# Altium project NUCLEO-F410RB-Extend-Board.PrjPcb
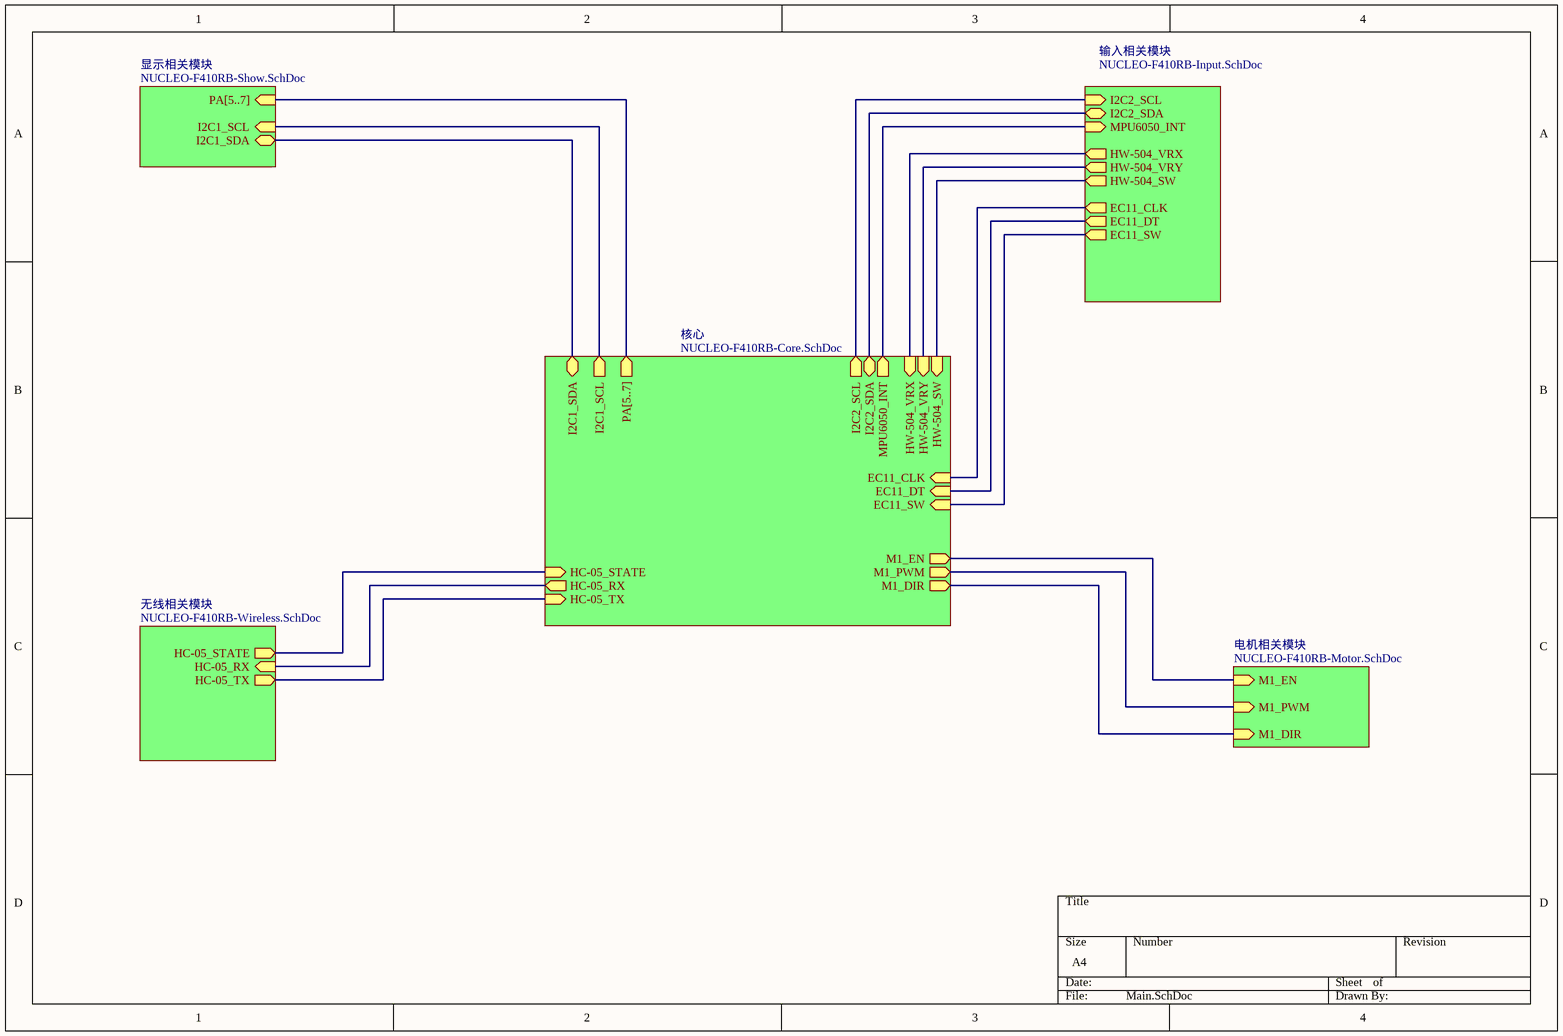
[diagram p0: Main.SchDoc]
6 sheets, 60 parts. Net scope: hierarchical (ports join the sheet entries above them; power ports are global).
Board file: NUCLEO-F410RB-Extend-Board.PcbDoc
Sheets:
  Main.SchDoc
    核心 = NUCLEO-F410RB-Core.SchDoc
    输入相关模块 = NUCLEO-F410RB-Input.SchDoc
    电机相关模块 = NUCLEO-F410RB-Motor.SchDoc
    显示相关模块 = NUCLEO-F410RB-Show.SchDoc
    无线相关模块 = NUCLEO-F410RB-Wireless.SchDoc

## Sheet Main.SchDoc
size A4

### Sub-sheets
无线相关模块 = NUCLEO-F410RB-Wireless.SchDoc: HC-05_STATE (out), HC-05_RX (in), HC-05_TX (out)
显示相关模块 = NUCLEO-F410RB-Show.SchDoc: PA[5..7] (in), I2C1_SCL (in), I2C1_SDA (bidir)
核心 = NUCLEO-F410RB-Core.SchDoc: M1_EN (out), M1_PWM (out), M1_DIR (out), PA[5..7] (out), I2C1_SCL (out), I2C1_SDA (bidir), I2C2_SCL (out), I2C2_SDA (bidir), MPU6050_INT (out), HW-504_VRX (in), HW-504_VRY (in), HW-504_SW (in), EC11_CLK (in), EC11_DT (in), EC11_SW (in), HC-05_STATE (in), HC-05_RX (out), HC-05_TX (in)
电机相关模块 = NUCLEO-F410RB-Motor.SchDoc: M1_EN (in), M1_PWM (in), M1_DIR (in)
输入相关模块 = NUCLEO-F410RB-Input.SchDoc: I2C2_SCL (in), I2C2_SDA (bidir), MPU6050_INT (in), HW-504_VRX (out), HW-504_VRY (out), HW-504_SW (out), EC11_CLK (out), EC11_DT (out), EC11_SW (out)

### Nets
EC11_CLK: sheet 核心/EC11_CLK, sheet 输入相关模块/EC11_CLK
EC11_DT: sheet 核心/EC11_DT, sheet 输入相关模块/EC11_DT
EC11_SW: sheet 核心/EC11_SW, sheet 输入相关模块/EC11_SW
HC-05_RX: sheet 核心/HC-05_RX, sheet 无线相关模块/HC-05_RX
HC-05_STATE: sheet 核心/HC-05_STATE, sheet 无线相关模块/HC-05_STATE
HC-05_TX: sheet 核心/HC-05_TX, sheet 无线相关模块/HC-05_TX
I2C1_SCL: sheet 核心/I2C1_SCL, sheet 显示相关模块/I2C1_SCL
I2C1_SDA: sheet 核心/I2C1_SDA, sheet 显示相关模块/I2C1_SDA
MPU6050_INT: sheet 核心/MPU6050_INT, sheet 输入相关模块/MPU6050_INT
MPU6050_SCL: sheet 核心/I2C2_SCL, sheet 输入相关模块/I2C2_SCL
MPU6050_SDA: sheet 核心/I2C2_SDA, sheet 输入相关模块/I2C2_SDA
PC10: sheet 核心/M1_EN, sheet 电机相关模块/M1_EN
PC11: sheet 核心/M1_DIR, sheet 电机相关模块/M1_DIR
PC12: sheet 核心/M1_PWM, sheet 电机相关模块/M1_PWM
PC13: sheet 核心/HW-504_VRX, sheet 输入相关模块/HW-504_VRX
PC14: sheet 核心/HW-504_VRY, sheet 输入相关模块/HW-504_VRY
PC15: sheet 核心/HW-504_SW, sheet 输入相关模块/HW-504_SW

### Buses and harness runs
bus sheet 显示相关模块/PA[5..7] = sheet 核心/PA[5..7]

## Sheet NUCLEO-F410RB-Core.SchDoc: NUCLEO-F410RB 扩展板
size A4; Revision: V1.0
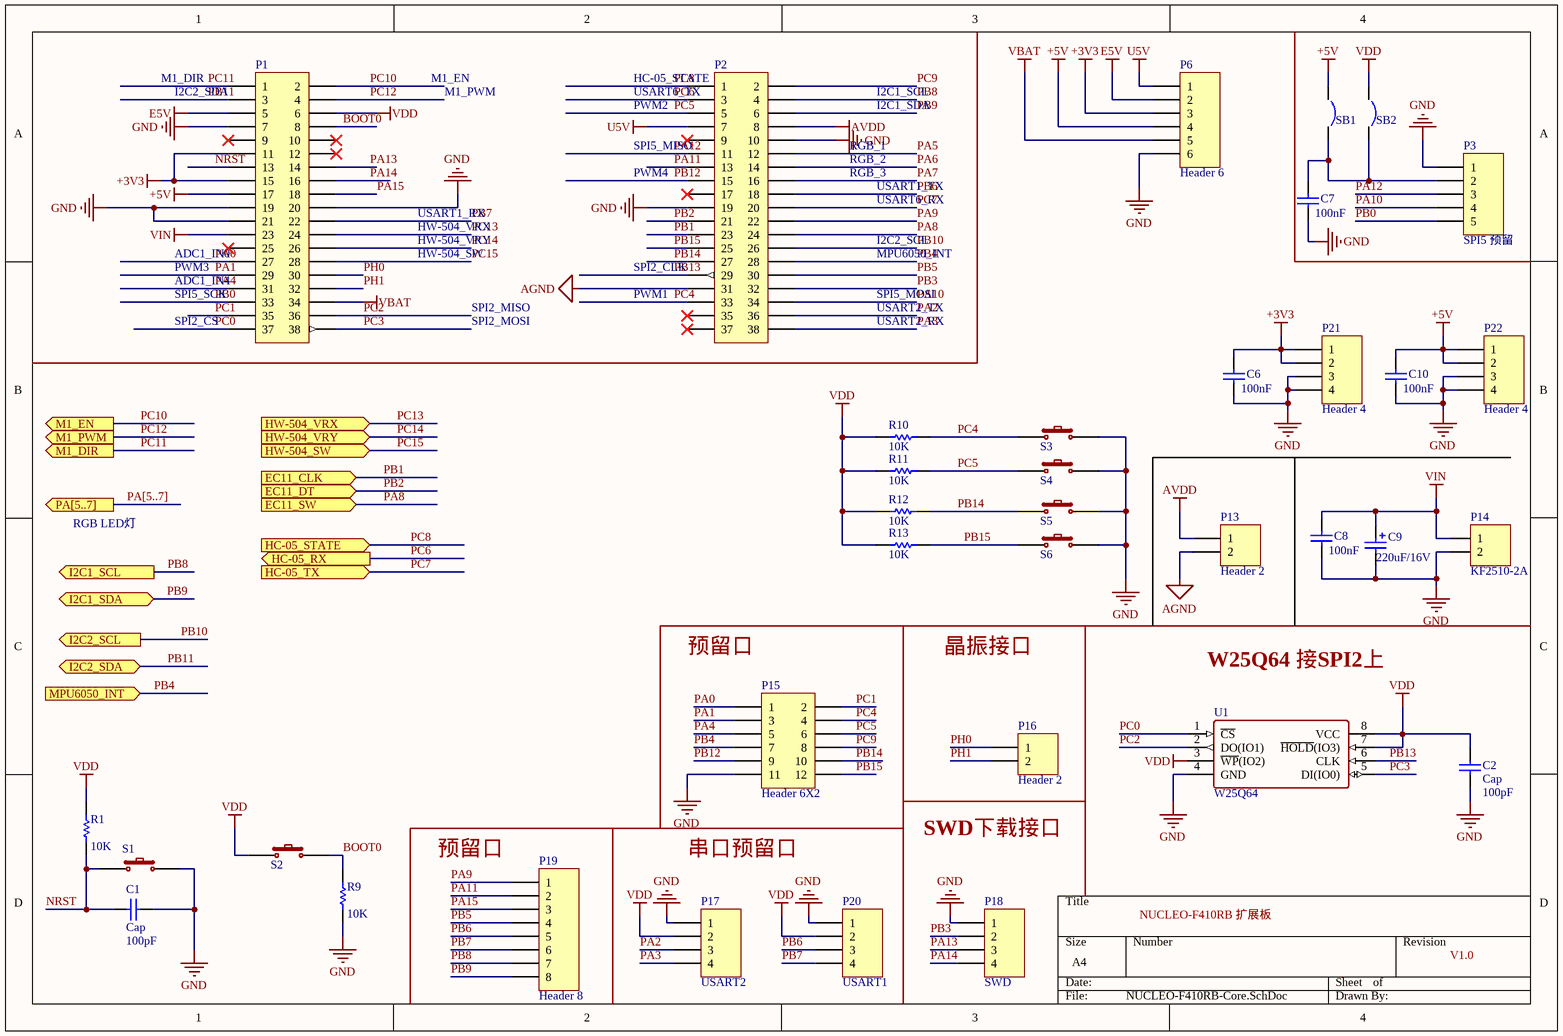
[diagram p1: NUCLEO-F410RB-Core.SchDoc]

### Parts
C1  Cap  value 100pF  [C0603]
C2  Cap  value 100pF  [C0603]
C6  value 100nF  [C0603]  (hidden comment: Cap)
C7  value 100nF  [C0603]  (hidden comment: Cap)
C8  value 100nF  [C0603]  (hidden comment: Cap)
C9  value 220uF/16V  [CAP-TH_BD6.3-P2.50-D1.0-FD]  (hidden comment: Cap Pol1)
C10  value 100nF  [C0603]  (hidden comment: Cap)
P1  HDR-F-2.54_2x19  [HDR2X19]  (value not drawn)
P2  HDR-F-2.54_2x19  [HDR2X19]  (value not drawn)
P3  SPI5 预留  [HDR1X5-Male]
P6  Header 6  [HDR1X6]
P13  Header 2  [HDR1X2]
P14  KF2510-2A  [KF2510-2A]
P15  Header 6X2  [HDR2X6]
P16  Header 2  [HDR1X2]
P17  USART2  [HDR1X4-Male]
P18  SWD  [HDR1X4-Male]
P19  Header 8  [HDR1X8-Male]
P20  USART1  [HDR1X4-Male]
P21  Header 4  [HDR1X4-Male]
P22  Header 4  [HDR1X4-Male]
R1  value 10K  [R0603]  (hidden comment: Res_US)
R9  value 10K  [R0603]  (hidden comment: Res_US)
R10  value 10K  [R0603]  (hidden comment: Res_US)
R11  value 10K  [R0603]  (hidden comment: Res_US)
R12  value 10K  [R0603]  (hidden comment: Res_US)
R13  value 10K  [R0603]  (hidden comment: Res_US)
S1  K2-SMD_L6x_W3.5_LS8.0  [SW-SMD_L6.0-W3.5-LS8.0]  (value not drawn)
S2  K2-SMD_L6x_W3.5_LS8.0  [SW-SMD_L6.0-W3.5-LS8.0]  (value not drawn)
S3  K2-SMD_L6x_W3.5_LS8.0  [SW-SMD_L6.0-W3.5-LS8.0]  (value not drawn)
S4  K2-SMD_L6x_W3.5_LS8.0  [SW-SMD_L6.0-W3.5-LS8.0]  (value not drawn)
S5  K2-SMD_L6x_W3.5_LS8.0  [SW-SMD_L6.0-W3.5-LS8.0]  (value not drawn)
S6  K2-SMD_L6x_W3.5_LS8.0  [SW-SMD_L6.0-W3.5-LS8.0]  (value not drawn)
SB1  Circuit Breaker  [JP2_SMD]  (value not drawn)
SB2  Circuit Breaker  [JP2_SMD]  (value not drawn)
U1  W25Q64  [SOIC-8_208mil_L5.3-W5.3-P1.27-LS8.0-BL]

### Ports
EC11_CLK (in), EC11_DT (in), EC11_SW (in), HC-05_RX (out), HC-05_STATE (in), HC-05_TX (in), HW-504_SW (in), HW-504_VRX (in), HW-504_VRY (in), I2C1_SCL (out), I2C1_SDA (bidir), I2C2_SCL (out), I2C2_SDA (bidir), M1_DIR (out), M1_EN (out), M1_PWM (out), MPU6050_INT (in), PA[5..7] (out)

### Nets
+3V3: C6.2 P1.11 P1.15 P6.3 P21.1 P21.2
+5V: C10.2 P1.17 P6.4 P22.1 P22.2 SB1.1
AGND: P2.31 P13.2
AVDD: P2.8 P13.1
E5V: P1.5 P6.2
GND: C1.2 C2.1 C6.1 C7.1 C8.1 C9.2 C10.1 P1.7 P1.19 P1.20 P1.21 P2.10 P2.19 P3.1 P6.6 P14.2 P15.11 P17.1 P18.1 P20.1 P21.3 P21.4 P22.3 P22.4 R9.1 S1.2 S3.2 S4.2 S5.2 S6.2 U1.4(GND)
U5V: P2.7 P6.1
VBAT: P1.34 P6.5
VDD: C2.2 P1.6 P17.2 P20.2 R1.2 R10.2 R11.2 R12.2 R13.2 S2.1 SB2.1 U1.3(~{WP}(IO2)) U1.7(~{HOLD}(IO3)) U1.8(VCC)
VIN: C8.2 C9.1 P1.23 P14.1
BOOT0: P1.8 R9.2 S2.2
NRST: C1.1 P1.13 R1.1 S1.1
PA0: P1.27 P15.1
PA1: P1.29 P15.3
PA2: P2.36 P17.3
PA3: P2.38 P17.4
PA4: P1.31 P15.5
PA5: P2.12
PA6: P2.14
PA7: P2.16
PA8: P2.24 ; port EC11_SW  [project net EC11_SW]
PA9: P2.22 P19.1
PA10: P2.34 P3.4
PA11: P2.13 P19.2
PA12: P2.11 P3.3
PA13: P1.14 P18.3
PA14: P1.16 P18.4
PA15: P1.18 P19.3
PB0: P1.33 P3.5
PB1: P2.23 ; port EC11_CLK  [project net EC11_CLK]
PB2: P2.21 ; port EC11_DT  [project net EC11_DT]
PB3: P2.32 P18.2
PB4: P2.28 P15.7 ; port MPU6050_INT  [project net MPU6050_INT]
PB5: P2.30 P19.4
PB6: P2.18 P19.5 P20.3
PB7: P1.22 P19.6 P20.4
PB8: P2.4 P19.7 ; port I2C1_SCL  [project net I2C1_SCL]
PB9: P2.6 P19.8 ; port I2C1_SDA  [project net I2C1_SDA]
PB10: P2.26 ; port I2C2_SCL  [project net MPU6050_SCL]
PB11: P1.3 ; port I2C2_SDA  [project net MPU6050_SDA]
PB12: P2.15 P15.9
PB13: P2.29 U1.6(CLK)
PB14: P2.27 P15.10 R12.1 S5.1
PB15: P2.25 P15.12 R13.1 S6.1
PC0: P1.37 U1.1(~{CS})
PC1: P1.35 P15.2
PC2: P1.36 U1.2(DO(IO1))
PC3: P1.38 U1.5(DI(IO0))
PC4: P2.33 P15.4 R10.1 S3.1
PC5: P2.5 P15.6 R11.1 S4.1
PC6: P2.3 ; port HC-05_RX  [project net HC-05_RX]
PC7: P2.20 ; port HC-05_TX  [project net HC-05_TX]
PC8: P2.1 ; port HC-05_STATE  [project net HC-05_STATE]
PC9: P2.2 P15.8
PC10: P1.2 ; port M1_EN
PC11: P1.1 ; port M1_DIR
PC12: P1.4 ; port M1_PWM
PC13: P1.24 ; port HW-504_VRX
PC14: P1.26 ; port HW-504_VRY
PC15: P1.28 ; port HW-504_SW
PH0: P1.30 P16.1
PH1: P1.32 P16.2
NetC7_2: C7.2 P3.2 SB1.2 SB2.2

Not connected (* = marked no-connect by the designer): P1 9* 10* 12* 25*; P2 9* 17* 35* 37*

### Buses and harness runs
bus PA[5..7] = port PA[5..7]

### Notes on the sheet
- M1_DIR
- I2C2_SDA
- M1_EN
- M1_PWM
- USART6_TX
- PWM2
- HC-05_STATE
- I2C1_SDA
- I2C1_SCL
- PWM4
- SPI5_MISO
- (near P2) RGB_1
- (near P2) RGB_2
- (near P2) RGB_3
- (near P1) HW-504_VRX
- (near P1) HW-504_VRY
- (near P1) USART1_RX
- I2C2_SCL
- (near P2) USART6_RX
- (near P2) USART1_TX
- SPI5_SCK
- ADC1_IN4
- PWM3
- ADC1_IN0
- (near P1) HW-504_SW
- SPI2_MISO
- SPI2_CLK
- PWM1
- (near P2) USART2_TX
- (near P2) SPI5_MOSI
- (near P2) MPU6050_INT
- SPI2_CS
- SPI2_MOSI
- (near P2) USART2_RX
- RGB LED灯
- 预留口
- 晶振接口
- W25Q64 接SPI2上
- SWD下载接口
- 串口预留口

### Library data of the parts
C1 C2 = Cap: 无极性电容; Published: 8-Jun-2000; LatestRevisionDate: 17-Jul-2002; LatestRevisionNote: Re-released for DXP Platform.; PackageReference: RAD-0.3; Publisher: Altium Limited; PackageDescription: Radial Cap, Thru-Hole; 2 Leads; 0.3 in Pin Spacing
C6-C8 C10 = Cap: Capacitor; Published: 8-Jun-2000; LatestRevisionDate: 17-Jul-2002; LatestRevisionNote: Re-released for DXP Platform.; PackageReference: RAD-0.3; Publisher: Altium Limited; PackageDescription: Radial Cap, Thru-Hole; 2 Leads; 0.3 in Pin Spacing
C9 = Cap Pol1: 有极性电容; Published: 2020-7-27; Publisher: 信念D力量; LCSC_ID: C18104
P1 P2 = HDR-F-2.54_2x19: 2.54mm 母头排针座; LatestRevisionDate: 17-Jul-2002; LatestRevisionNote: Re-released for DXP Platform.; Publisher: Altium Limited
P3 = Header 5: Header, 5-Pin; LatestRevisionDate: 17-Jul-2002; LatestRevisionNote: Re-released for DXP Platform.; Publisher: Altium Limited
P6 = Header 6: Header, 6-Pin; LatestRevisionDate: 17-Jul-2002; LatestRevisionNote: Re-released for DXP Platform.; Publisher: Altium Limited
P13 P16 = Header 2: Header, 2-Pin; LatestRevisionDate: 17-Jul-2002; LatestRevisionNote: Re-released for DXP Platform.; Publisher: Altium Limited
P14 = KF2510-2A: KF2510-2A 端子; LatestRevisionDate: 17-Jul-2002; LatestRevisionNote: Re-released for DXP Platform.; Publisher: Altium Limited
P15 = Header 6X2: Header, 6-Pin, Dual row; LatestRevisionDate: 17-Jul-2002; LatestRevisionNote: Re-released for DXP Platform.; Publisher: Altium Limited
P17 P18 P20-P22 = Header 4: Header, 4-Pin; LatestRevisionDate: 17-Jul-2002; LatestRevisionNote: Re-released for DXP Platform.; Publisher: Altium Limited
P19 = Header 8: Header, 8-Pin; LatestRevisionDate: 17-Jul-2002; LatestRevisionNote: Re-released for DXP Platform.; Publisher: Altium Limited
R1 R9-R13 = Res_US: Resistor; Published: 8-Jun-2000; LatestRevisionDate: 29-May-2009; LatestRevisionNote: IPC-7351 Footprint Added.; PackageReference: J1-0603; Publisher: Altium Limited; PackageDescription: Chip Resistor
S1-S6 = K2-SMD_L6x_W3.5_LS8.0: 轻触开关 K2-SMD_L6x_W3.5_LS8.0; Published: 24-Mar-1999; LatestRevisionDate: 17-Jul-2002; LatestRevisionNote: Re-released for DXP Platform.; PackageReference: SPST-2; Publisher: Altium Limited; PackageDescription: Switch; 2 Leads
SB1 SB2 = Circuit Breaker: Solder: NO; Published: 24-Mar-1999; Revision: July-2002: Re-released for DXP Platform.; Publisher: Altium Limited
U1 = W25Q64: FLASH存储器

## Sheet NUCLEO-F410RB-Input.SchDoc
size A4
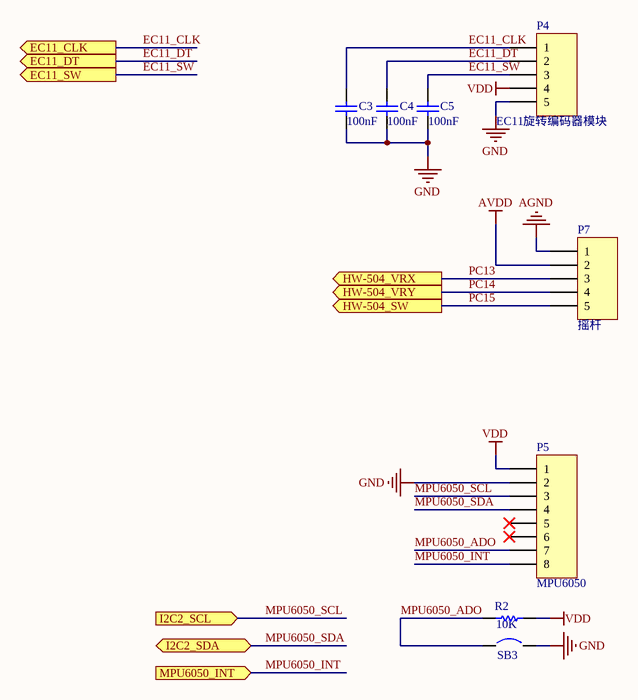
[diagram p2: NUCLEO-F410RB-Input.SchDoc]

### Parts
C3  value 100nF  [C0603]  (hidden comment: Cap)
C4  value 100nF  [C0603]  (hidden comment: Cap)
C5  value 100nF  [C0603]  (hidden comment: Cap)
P4  EC11旋转编码器模块  [HDR1X5-Male]
P5  MPU6050  [HDR1X8]
P7  摇杆  [HDR1X5-Male]
R2  value 10K  [R0603]  (hidden comment: Res_US)
SB3  Circuit Breaker  [JP2_SMD]  (value not drawn)

### Ports
EC11_CLK (out), EC11_DT (out), EC11_SW (out), HW-504_SW (out), HW-504_VRX (out), HW-504_VRY (out), I2C2_SCL (in), I2C2_SDA (bidir), MPU6050_INT (in)

### Nets
AGND: P7.1
AVDD: P7.2
GND: C3.1 C4.1 C5.1 P4.5 P5.2 SB3.2
VDD: P4.4 P5.1 R2.2
EC11_CLK: C3.2 P4.1 ; port EC11_CLK
EC11_DT: C4.2 P4.2 ; port EC11_DT
EC11_SW: C5.2 P4.3 ; port EC11_SW
MPU6050_ADO: P5.7 R2.1 SB3.1
MPU6050_INT: P5.8 ; port MPU6050_INT
MPU6050_SCL: P5.3 ; port I2C2_SCL
MPU6050_SDA: P5.4 ; port I2C2_SDA
PC13: P7.3 ; port HW-504_VRX
PC14: P7.4 ; port HW-504_VRY
PC15: P7.5 ; port HW-504_SW

Not connected (* = marked no-connect by the designer): P5 5* 6*

### Library data of the parts
C3-C5 = Cap: 无极性电容; Published: 8-Jun-2000; LatestRevisionDate: 17-Jul-2002; LatestRevisionNote: Re-released for DXP Platform.; PackageReference: RAD-0.3; Publisher: Altium Limited; PackageDescription: Radial Cap, Thru-Hole; 2 Leads; 0.3 in Pin Spacing
P4 P7 = Header 5: Header, 5-Pin; LatestRevisionDate: 17-Jul-2002; LatestRevisionNote: Re-released for DXP Platform.; Publisher: Altium Limited
P5 = Header 8: Header, 8-Pin; LatestRevisionDate: 17-Jul-2002; LatestRevisionNote: Re-released for DXP Platform.; Publisher: Altium Limited
R2 = Res_US: Resistor; Published: 8-Jun-2000; LatestRevisionDate: 29-May-2009; LatestRevisionNote: IPC-7351 Footprint Added.; PackageReference: J1-0603; Publisher: Altium Limited; PackageDescription: Chip Resistor
SB3 = Circuit Breaker: Solder: NO; Published: 24-Mar-1999; Revision: July-2002: Re-released for DXP Platform.; Publisher: Altium Limited

## Sheet NUCLEO-F410RB-Motor.SchDoc
size A4
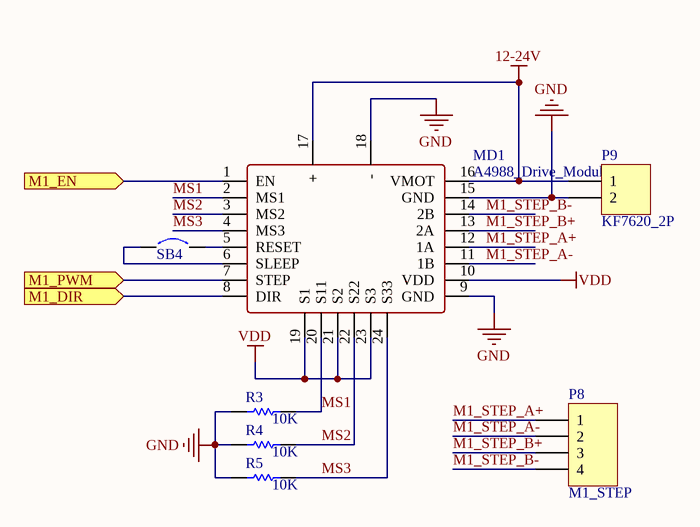
[diagram p3: NUCLEO-F410RB-Motor.SchDoc]

### Parts
MD1  A4988_Drive_Module  [A4988_Module]
P8  M1_STEP  [HDR1X4-Male]
P9  KF7620_2P  [KF-7.62-2P]
R3  value 10K  [R0603]  (hidden comment: Res_US)
R4  value 10K  [R0603]  (hidden comment: Res_US)
R5  value 10K  [R0603]  (hidden comment: Res_US)
SB4  Circuit Breaker  [JP2_SMD]  (value not drawn)

### Ports
M1_DIR (in), M1_EN (in), M1_PWM (in)

### Nets
12-24V: MD1.16(VMOT) MD1.17(+) P9.1
GND: MD1.9(GND) MD1.15(GND) MD1.18(-) P9.2 R3.1 R4.1 R5.1
VDD: MD1.10(VDD) MD1.19(S1) MD1.21(S2) MD1.23(S3)
M1_STEP_A+: MD1.12(1A) P8.1
M1_STEP_A-: MD1.11(1B) P8.2
M1_STEP_B+: MD1.13(2A) P8.3
M1_STEP_B-: MD1.14(2B) P8.4
MS1: MD1.2(MS1) MD1.20(S11) R3.2
MS2: MD1.3(MS2) MD1.22(S22) R4.2
MS3: MD1.4(MS3) MD1.24(S33) R5.2
PC10: MD1.1(EN) ; port M1_EN
PC11: MD1.8(DIR) ; port M1_DIR
PC12: MD1.7(STEP) ; port M1_PWM
NetMD1_5: MD1.5(RESET) SB4.2
NetMD1_6: MD1.6(SLEEP) SB4.1

### Library data of the parts
P8 = Header 4: Header, 4-Pin; LatestRevisionDate: 17-Jul-2002; LatestRevisionNote: Re-released for DXP Platform.; Publisher: Altium Limited
P9 = KF7620_2P: KF7620 接线端子; LatestRevisionDate: 17-Jul-2002; LatestRevisionNote: Re-released for DXP Platform.; Publisher: Altium Limited
R3-R5 = Res_US: Resistor; Published: 8-Jun-2000; LatestRevisionDate: 29-May-2009; LatestRevisionNote: IPC-7351 Footprint Added.; PackageReference: J1-0603; Publisher: Altium Limited; PackageDescription: Chip Resistor
SB4 = Circuit Breaker: Solder: NO; Published: 24-Mar-1999; Revision: July-2002: Re-released for DXP Platform.; Publisher: Altium Limited

## Sheet NUCLEO-F410RB-Show.SchDoc
size A4
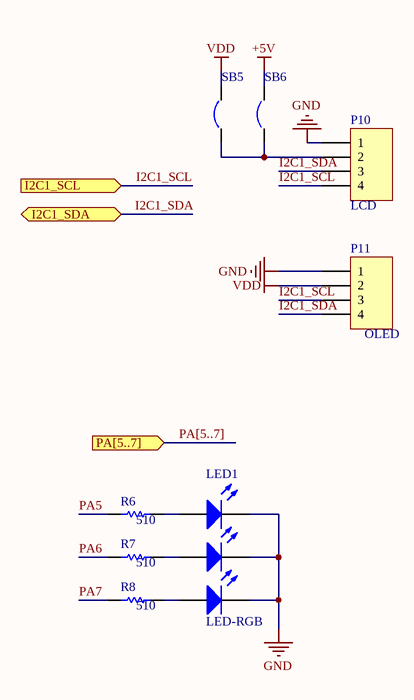
[diagram p4: NUCLEO-F410RB-Show.SchDoc]

### Parts
LED1  LED-RGB  [LED-SMD_6PIN-L1.60-W1.50-BL-RD]
P10  LCD  [HDR1X4]
P11  OLED  [HDR1X4]
R6  value 510  [R0603]  (hidden comment: Res_US)
R7  value 510  [R0603]  (hidden comment: Res_US)
R8  value 510  [R0603]  (hidden comment: Res_US)
SB5  Circuit Breaker  [JP2_SMD]  (value not drawn)
SB6  Circuit Breaker  [JP2_SMD]  (value not drawn)

### Ports
I2C1_SCL (in), I2C1_SDA (bidir), PA[5..7] (in)

### Nets
+5V: SB6.2
GND: LED1.4(K) LED1.5(K) LED1.6(K) P10.1 P11.1
VDD: P11.2 SB5.2
I2C1_SCL: P10.4 P11.3 ; port I2C1_SCL
I2C1_SDA: P10.3 P11.4 ; port I2C1_SDA
PA5: R6.2
PA6: R7.2
PA7: R8.2
NetLED1_1: LED1.1(A) R6.1
NetLED1_2: LED1.2(A) R7.1
NetLED1_3: LED1.3(A) R8.1
NetP10_2: P10.2 SB5.1 SB6.1

### Buses and harness runs
bus PA[5..7] = port PA[5..7]

### Library data of the parts
LED1 = LED-RGB: Typical INFRARED GaAs LED; Published: 8-Jun-2000; LatestRevisionDate: 08-Jul-2005; LatestRevisionNote: Mech Layer 1 removed.; PackageReference: LED-0; Publisher: Altium Limited; PackageDescription: LED; 2 Leads
P10 P11 = Header 4: Header, 4-Pin; LatestRevisionDate: 17-Jul-2002; LatestRevisionNote: Re-released for DXP Platform.; Publisher: Altium Limited
R6-R8 = Res_US: Resistor; Published: 8-Jun-2000; LatestRevisionDate: 29-May-2009; LatestRevisionNote: IPC-7351 Footprint Added.; PackageReference: J1-0603; Publisher: Altium Limited; PackageDescription: Chip Resistor
SB5 SB6 = Circuit Breaker: Solder: NO; Published: 24-Mar-1999; Revision: July-2002: Re-released for DXP Platform.; Publisher: Altium Limited

## Sheet NUCLEO-F410RB-Wireless.SchDoc
size A4
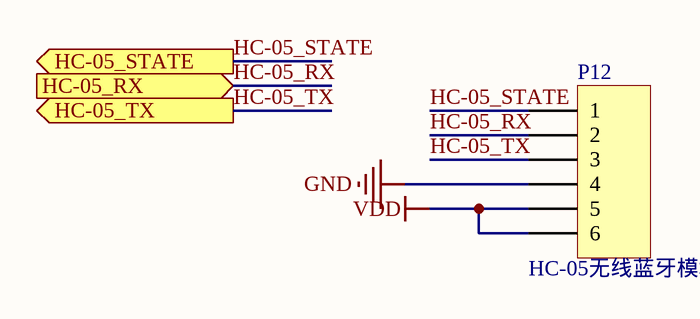
[diagram p5: NUCLEO-F410RB-Wireless.SchDoc]

### Parts
P12  HC-05无线蓝牙模块  [HDR1X6]

### Ports
HC-05_RX (in), HC-05_STATE (out), HC-05_TX (out)

### Nets
GND: P12.4
VDD: P12.5 P12.6
HC-05_RX: P12.2 ; port HC-05_RX
HC-05_STATE: P12.1 ; port HC-05_STATE
HC-05_TX: P12.3 ; port HC-05_TX

### Library data of the parts
P12 = Header 6: Header, 6-Pin; LatestRevisionDate: 17-Jul-2002; LatestRevisionNote: Re-released for DXP Platform.; Publisher: Altium Limited

## Nets that join several sheets
+5V: NUCLEO-F410RB-Core (6 pins), NUCLEO-F410RB-Show (SB6.2)
AGND: NUCLEO-F410RB-Core (P2.31 P13.2), NUCLEO-F410RB-Input (P7.1)
AVDD: NUCLEO-F410RB-Core (P2.8 P13.1), NUCLEO-F410RB-Input (P7.2)
GND: NUCLEO-F410RB-Core (31 pins), NUCLEO-F410RB-Input (6 pins), NUCLEO-F410RB-Motor (7 pins), NUCLEO-F410RB-Show (5 pins), NUCLEO-F410RB-Wireless (P12.4)
VDD: NUCLEO-F410RB-Core (14 pins), NUCLEO-F410RB-Input (P4.4 P5.1 R2.2), NUCLEO-F410RB-Motor (MD1.10 MD1.19 MD1.21 MD1.23), NUCLEO-F410RB-Show (P11.2 SB5.2), NUCLEO-F410RB-Wireless (P12.5 P12.6)
EC11_CLK: NUCLEO-F410RB-Core (P2.23), NUCLEO-F410RB-Input (C3.2 P4.1)
EC11_DT: NUCLEO-F410RB-Core (P2.21), NUCLEO-F410RB-Input (C4.2 P4.2)
EC11_SW: NUCLEO-F410RB-Core (P2.24), NUCLEO-F410RB-Input (C5.2 P4.3)
HC-05_RX: NUCLEO-F410RB-Core (P2.3), NUCLEO-F410RB-Wireless (P12.2)
HC-05_STATE: NUCLEO-F410RB-Core (P2.1), NUCLEO-F410RB-Wireless (P12.1)
HC-05_TX: NUCLEO-F410RB-Core (P2.20), NUCLEO-F410RB-Wireless (P12.3)
I2C1_SCL: NUCLEO-F410RB-Core (P2.4 P19.7), NUCLEO-F410RB-Show (P10.4 P11.3)
I2C1_SDA: NUCLEO-F410RB-Core (P2.6 P19.8), NUCLEO-F410RB-Show (P10.3 P11.4)
MPU6050_INT: NUCLEO-F410RB-Core (P2.28 P15.7), NUCLEO-F410RB-Input (P5.8)
MPU6050_SCL: NUCLEO-F410RB-Core (P2.26), NUCLEO-F410RB-Input (P5.3)
MPU6050_SDA: NUCLEO-F410RB-Core (P1.3), NUCLEO-F410RB-Input (P5.4)
PA5: NUCLEO-F410RB-Core (P2.12), NUCLEO-F410RB-Show (R6.2)
PA6: NUCLEO-F410RB-Core (P2.14), NUCLEO-F410RB-Show (R7.2)
PA7: NUCLEO-F410RB-Core (P2.16), NUCLEO-F410RB-Show (R8.2)
PC10: NUCLEO-F410RB-Core (P1.2), NUCLEO-F410RB-Motor (MD1.1)
PC11: NUCLEO-F410RB-Core (P1.1), NUCLEO-F410RB-Motor (MD1.8)
PC12: NUCLEO-F410RB-Core (P1.4), NUCLEO-F410RB-Motor (MD1.7)
PC13: NUCLEO-F410RB-Core (P1.24), NUCLEO-F410RB-Input (P7.3)
PC14: NUCLEO-F410RB-Core (P1.26), NUCLEO-F410RB-Input (P7.4)
PC15: NUCLEO-F410RB-Core (P1.28), NUCLEO-F410RB-Input (P7.5)